# Altium schematic sheet LED_Controller.SchDoc: LED Module
size A; Author: Sam Tomlinson; SheetNumber: 3; SheetTotal: 6; TeamLead: John Ulm; ProjectTitle: LED Board
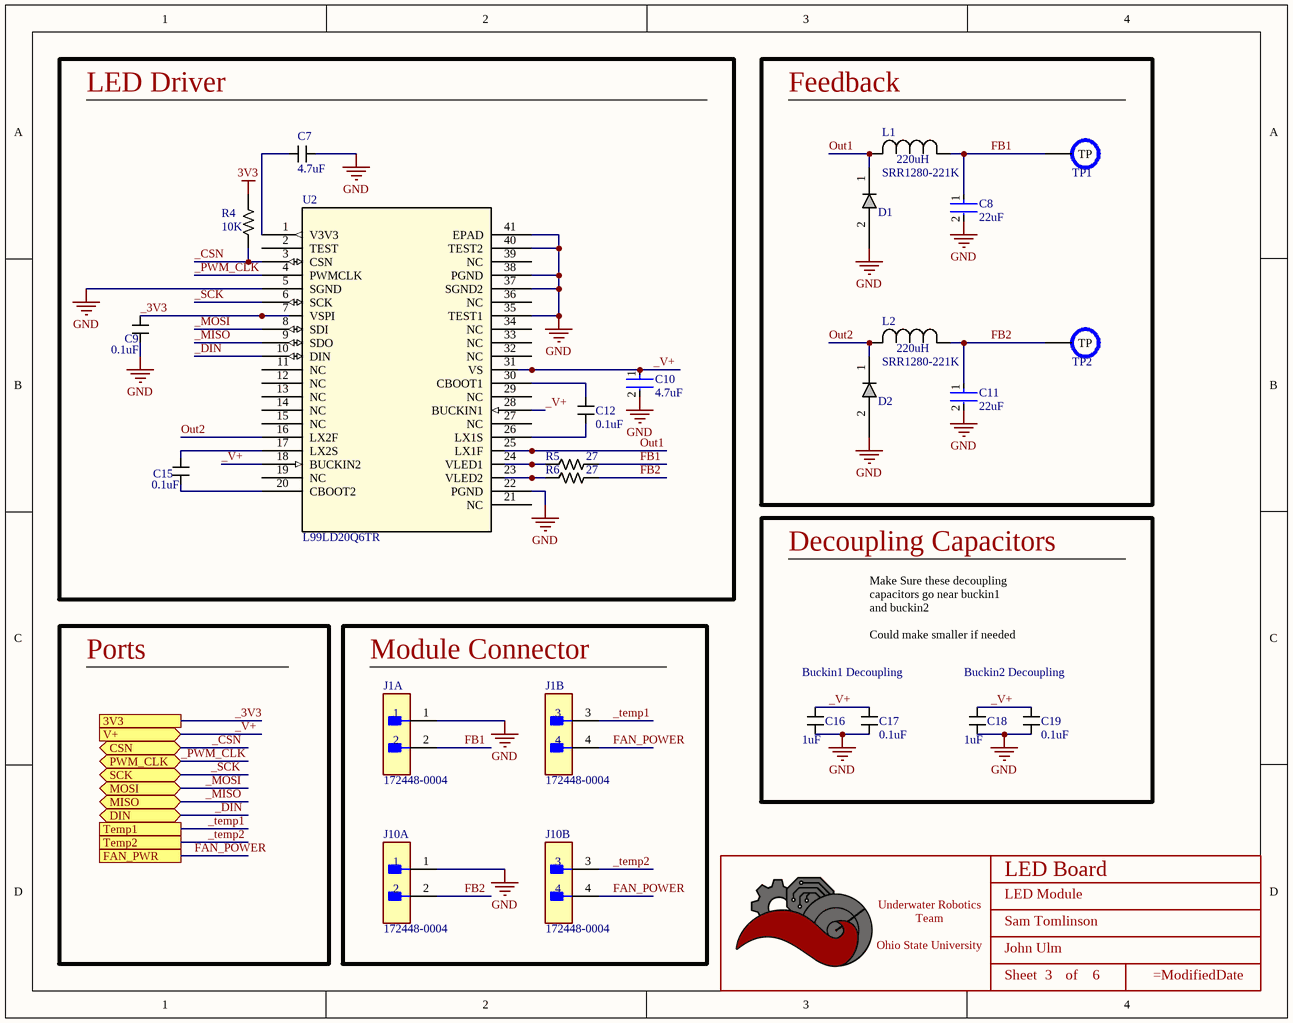
[diagram p0: LED_Controller.SchDoc]

## Parts
*  Title_Block  [LOGO]  (value not drawn)  (graphical)
C7  value 4.7uF  [CAPACITOR_0603]  (hidden comment: 4.7uF Ceramic 6.3V)
C8  22uF  [FP-C2012-125-0_2-MFG]
C9  value 0.1uF  [CAPACITOR_0603]  (hidden comment: 100nF Ceramic 6.3V)
C10  4.7uF  [CAPACITOR_0603]
C11  22uF  [FP-C2012-125-0_2-MFG]
C12  value 0.1uF  [CAPACITOR_0603]  (hidden comment: 100nF Ceramic 25V)
C15  value 0.1uF  [CAPACITOR_0603]  (hidden comment: 100nF Ceramic 25V)
C16  value 1uF  [CAPACITOR_0603]  (hidden comment: 1uF Ceramic 25V)
C17  value 0.1uF  [CAPACITOR_0603]  (hidden comment: 100nF Ceramic 25V)
C18  value 1uF  [CAPACITOR_0603]  (hidden comment: 1uF Ceramic 25V)
C19  value 0.1uF  [CAPACITOR_0603]  (hidden comment: 100nF Ceramic 25V)
D1  CCS15S40,L3F  [SOD-963   CST2C_TOS]  (value not drawn)
D2  CCS15S40,L3F  [SOD-963   CST2C_TOS]  (value not drawn)
J1  172448-0004  [FP-172448-0004-MFG]  (parts A,B of 2)
J10  172448-0004  [FP-172448-0004-MFG]  (parts A,B of 2)
L1  SRR1280-221K  [IND_BOURNS_SRR1280]
L2  SRR1280-221K  [IND_BOURNS_SRR1280]
R4  Value  (Ohms): 10K  [RESISTOR_0402]  (hidden comment: 10k Ohm 1% 1/16W)
R5  Value  (Ohms): 27  [RESISTOR_0603]  (hidden comment: 27 Ohm 5% 1/8W)
R6  Value  (Ohms): 27  [RESISTOR_0603]  (hidden comment: 27 Ohm 5% 1/8W)
TP1  PCB Test Point  [TESTPOINT_1.2MM]  (value not drawn)  (no BOM)
TP2  PCB Test Point  [TESTPOINT_1.2MM]  (value not drawn)  (no BOM)
U2  L99LD20Q6TR  [L99LD20Q6TR]

## Blocks framed on the sheet
LED Driver: C7 C9 C10 C12 C15 R4-R6 U2
Feedback: C8 C11 D1 D2 L1 L2 TP1 TP2
Decoupling Capacitors: C16-C19
Module Connector: J1 J10

## Ports
3V3, CSN (bidir), DIN (bidir), FAN_PWR, MISO (bidir), MOSI (bidir), PWM_CLK (bidir), SCK (bidir), Temp1, Temp2, V+ (in)

## Nets
3V3: R4.1
GND: C7.1 C8.2 C9.2 C10.2 C11.2 C16.1 C17.2 C18.1 C19.2 D1.2 D2.2 J1.1 J10.1 U2.5(SGND) U2.22(PGND) U2.35(TEST1) U2.37(SGND2) U2.38(PGND) U2.40(TEST2) U2.41(EPAD)
_3V3: C9.1 U2.7(VSPI) ; port 3V3
_CSN: R4.2 U2.3(CSN) ; port CSN
_DIN: U2.10(DIN) ; port DIN
_MISO: U2.9(SDO) ; port MISO
_MOSI: U2.8(SDI) ; port MOSI
_PWM_CLK: U2.4(PWMCLK) ; port PWM_CLK
_SCK: U2.6(SCK) ; port SCK
_temp1: J1.3 ; port Temp1
_temp2: J10.3 ; port Temp2
_V+: C10.1 C16.2 C17.1 C18.2 C19.1 U2.18(BUCKIN2) U2.28(BUCKIN1) U2.31(VS) ; port V+
FAN_POWER: J1.4 J10.4 ; port FAN_PWR
FB1: C8.1 J1.2 L1.1 R5.1 TP1.TP
FB2: C11.1 J10.2 L2.1 R6.1 TP2.TP
Out1: D1.1 L1.2 U2.25(LX1F)
Out2: D2.1 L2.2 U2.16(LX2F)
NetC7_2: C7.2 U2.1(V3V3)
NetC12_1: C12.1 U2.30(CBOOT1)
NetC12_2: C12.2 U2.26(LX1S)
NetC15_1: C15.1 U2.17(LX2S)
NetC15_2: C15.2 U2.20(CBOOT2)
NetR5_2: R5.2 U2.24(VLED1)
NetR6_2: R6.2 U2.23(VLED2)

Not connected (* = marked no-connect by the designer): U2 2(TEST) 11(NC) 12(NC) 13(NC) 14(NC) 15(NC) 19(NC) 21(NC) 27(NC) 29(NC) 32(NC) 33(NC) 34(NC) 36(NC) 39(NC)

## Notes on the sheet
- Ports
- Buckin1 Decoupling
- Make Sure these decoupling capacitors go near buckin1 and buckin2
  Could make smaller if needed
- Buckin2 Decoupling
- (in symbol INDUCTOR_SRR1280-221K) 220uH
- (in symbol Title_Block) Underwater Robotics Team / Ohio State University; Sheet; of

## Library data of the parts
* = Title_Block: UWRT Schematic Title Block Template / Created June 2021, Dylan Trainor
C7 = CAPACITOR_4.7uF_0603: Cap 4.7uF 6.3V +/-10% / Ceramic 0603; Made By: Robert Pafford; Tolerance: +/- 10%; Voltage: 6.3V; Supplier 1: Digi-Key; Supplier Part Number 1: 1276-2087-1-ND
C8 C11 = CMP-2000-06038-3: Multilayer Ceramic Capacitors 22μF ±20% 35V X5R SMD 0805; Tolerance: 20%; RoHS Compliant: Yes; Height: 1.25mm; Termination: SMD/SMT; Case/Package: 0805; Thickness: 0.057inch; Max Operating Temperature: 85°C; Min Operating Temperature: -55°C; Voltage Rating (DC): 35V; Length: 0.079inch; Dielectric: X5R; Dielectric Material: Ceramic; Capacitance: 22uF; Voltage Rating: 35V; Mount: Surface Mount; Package Quantity: 2000; Lead Free: Lead Free; Weight: 0.000194oz; REACH SVHC: No SVHC; Width: 0.049inch; Packaging: Tape and Reel; Series: C; Case Code (Metric): 2012; Case Code (Imperial): 0805
C9 = CAPACITOR_0.1uF_0603_1: Cap 100nF 6.3V +/-10% / Ceramic 0603; Made By: Flip B; ComponentLink1Description: Datsheet; ComponentLink1URL: https://www.mouser.com/datasheet/2/212/KEM_C1002_X7R_SMD-1102033.pdf; Tolerance: +/- 10%; Voltage: 6.3V; Supplier 1: Digi-Key; Supplier Part Number 1: 399-15351-1-ND
C10 = CAP CERM 4.7UF 20% 35V: Chip Multilayer Ceramic Capacitors for General Purpose, 0603, 4.7uF, X5R, 15%, 20%, 35V; Voltage Rating (DC): 35V; Capacitance: 4.7uF; Dielectric: X5R; Case/Package: 0603; Min Operating Temperature: -55°C; Weight: 0.000222oz; Tolerance: 20%; Termination: SMD/SMT; Case Code (Imperial): 0603; Resistor Type: Ceramic; Thickness: 0.039inch; Case Code (Metric): 1608; Width: 0.8mm; Max Operating Temperature: 85°C; Mount: Surface Mount; Length: 0.063inch; Package Quantity: 4000; Height: 0.8mm; Voltage Rating: 35V; Packaging: Tape and Reel; Supplier 1: Arrow Electronics; Supplier Part Number 1: GRM188R6YA475ME15D
C12 C15 C17 C19 = CAPACITOR_0.1uF_0603_25V: Cap 100nF 25V +/-10% / Ceramic 0603; Voltage: 6.3V; Made By: Flip B; ComponentLink1Description: Datsheet; ComponentLink1URL: https://www.mouser.com/datasheet/2/212/KEM_C1002_X7R_SMD-1102033.pdf; Tolerance: +/- 10%; Supplier 1: Digikey; Supplier Part Number 1: 1276-1006-1-ND
C16 C18 = CAPACITOR_1uF_0603_25V: Cap 1uF 25V +/-10% / Ceramic 0603; Voltage: 16V; Made By: Flip B; Tolerance: +/- 10%; Supplier 1: Digikey; Supplier Part Number 1: 1276-1102-1-ND
D1 D2 = SCHOTTKY_40V_1.5A: DIODE SCHOTTKY 40V 1.5A CST2C; Mfr_Name: Toshiba Electronic Devices & Storage Corp.; Type: DEV; Copyright: Copyright (C) 2023 Ultra Librarian. All rights reserved.; Manufacturer_Part_Number: CCS15S40,L3F; RefDes: RefDes; Supplier 1: Digi-Key; Supplier Part Number 1: CCS15S40L3FCT-ND
J1 J10 = CMP-00257-52824861-1: 172448-0004 Conn Power HDR 4 POS 4.2mm Solder RA Thru-Hole 4 Terminal 1 Port Mini-Fit Jr™ Frame; Manufacturer Lifecycle Status: ACTIVE; Current Rating: 13A; Voltage Rating: 600V; Row Spacing: 4.191mm; Number of Positions: 4; Connector Type: Male Pin; Glow Wire Compliant: Compliant; Contact Material: Tin; Min Operating Temperature: -40°C; Number of Rows: 2; NexarPartId: 52824861; Height: 12.03mm; Max Operating Temperature: 105°C; Pitch: 4.191mm; Number of Contacts: 4; RoHS: Compliant; Lifecycle Status: Production; Fastening Type: Ramp; Orientation: Right Angle; Mount: Through Hole; Termination: Solder; Color: Black; Number of Circuits: 4; Country of Origin: US; Contact Plating: Tin
L1 L2 = INDUCTOR_SRR1280-221K: 220 µH Shielded Drum Core, Wirewound Inductor 1.6 A 400mOhm Max Nonstandard; Mfr_Name: Bourns Electronics; Type: DEV; Copyright: Copyright (C) 2023 Ultra Librarian. All rights reserved.; Manufacturer_Part_Number: SRR1280-221K; RefDes: RefDes; Supplier 1: Digi-Key; Supplier Part Number 1: SRR1280-221KLCT-ND
R4 = RESISTOR_10K_0402: RES 10k OHM 1% 1/16W 0402; Tolerance: +/- 1%; Made By: Robert Pafford; Wattage: 1/16W; Supplier: Digikey; Digikey Part Numer: CR0603-JW-104ELFTR-ND; Supplier 1: Digi-Key; Supplier Part Number 1: YAG3436CT-ND
R5 R6 = RESISTOR_27_0603: RES 27 OHM 5% 1/8W 0603; Tolerance: +/- 5%; Made By: Robert Pafford; ComponentLink1Description: Datasheet; ComponentLink1URL: https://www.bourns.com/docs/product-datasheets/CRxxxxx.pdf; Wattage: 1/8W; Supplier: Digikey; Digikey Part Numer: CR0603-JW-104ELFTR-ND; Supplier 1: Digi-Key; Supplier Part Number 1: 2019-RK73B1JTTD270JCT-ND
TP1 TP2 = TESTPOINT: Made By: Robert Pafford
U2 = L99LD20Q6TR: IC LED DRVR RGLTR PWM 1.5A 40QFN; Mfr_Name: STMicroelectronics; Copyright: Copyright (C) 2023 Ultra Librarian. All rights reserved.; Manufacturer_Part_Number: L99LD20Q6TR; RefDes: RefDes; Type: DEV; Supplier 1: Digi-Key; Supplier Part Number 1: 497-18126-1-ND